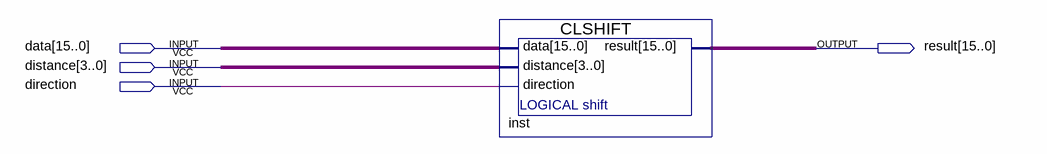
[diagram p0: schematic sheet]
// Quartus schematic lab403CLSHIFT.bdf as structural Verilog: 1 symbols, 4 pins
module lab403CLSHIFT (
  input  [15:0] data,
  input  [3:0] distance,
  input  direction,
  output [15:0] result
);

  CLSHIFT inst (.data(data), .distance(distance), .direction(direction), .result(result));
endmodule
